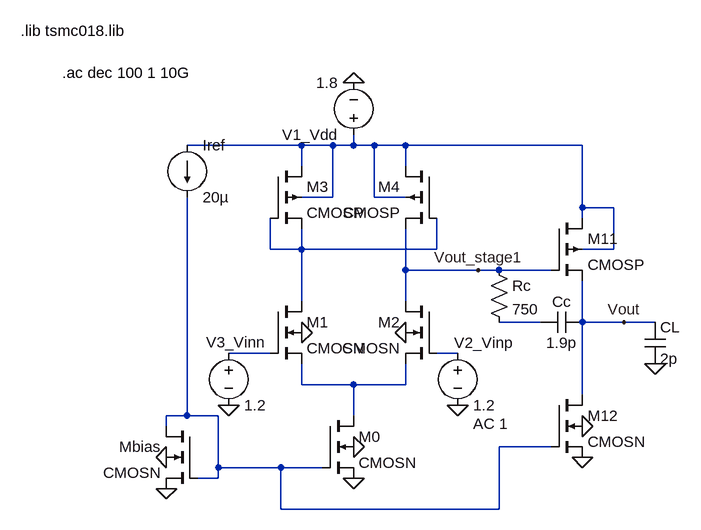
[diagram p0: schematic stage12_ac_refined_gui.asc]
stage12_ac_refined_gui.asc, the LTspice schematic file:
Version 4.1
SHEET 1 880 680
WIRE 96 -128 -80 -128
WIRE 144 -128 96 -128
WIRE 176 -128 176 -144
WIRE 176 -128 144 -128
WIRE 208 -128 176 -128
WIRE 256 -128 208 -128
WIRE 528 -128 256 -128
WIRE 96 -96 96 -128
WIRE 256 -96 256 -128
WIRE 144 -48 144 -128
WIRE 144 -48 96 -48
WIRE 208 -48 208 -128
WIRE 256 -48 208 -48
WIRE 528 -32 528 -128
WIRE 576 -32 528 -32
WIRE 528 -16 528 -32
WIRE 48 32 48 -16
WIRE 96 32 96 0
WIRE 96 32 48 32
WIRE 304 32 304 -16
WIRE 304 32 96 32
WIRE 576 32 576 -32
WIRE 576 32 528 32
WIRE 256 64 256 0
WIRE 368 64 256 64
WIRE 400 64 368 64
WIRE 480 64 400 64
WIRE 96 112 96 32
WIRE 256 112 256 64
WIRE 464 144 400 144
WIRE 528 144 528 80
WIRE 592 144 528 144
WIRE 640 144 592 144
WIRE 48 192 -16 192
WIRE 336 192 304 192
WIRE 96 240 96 208
WIRE 176 240 96 240
WIRE 256 240 256 208
WIRE 256 240 176 240
WIRE 528 256 528 144
WIRE -80 288 -80 -48
WIRE -80 288 -112 288
WIRE -32 288 -80 288
WIRE 176 288 176 240
WIRE -112 304 -112 288
WIRE 480 336 400 336
WIRE -32 368 -32 288
WIRE 64 368 -32 368
WIRE 128 368 64 368
WIRE -32 384 -32 368
WIRE -32 384 -64 384
WIRE 64 432 64 368
WIRE 400 432 400 336
WIRE 400 432 64 432
FLAG 176 -224 0
FLAG -112 352 0
FLAG 176 336 0
FLAG 96 160 0
FLAG 256 160 0
FLAG 336 272 0
FLAG -16 272 0
FLAG -112 400 0
FLAG 176 384 0
FLAG 640 208 0
FLAG 528 352 0
FLAG 528 304 0
FLAG 592 144 Vout
FLAG 368 64 Vout_stage1
SYMBOL cmosn 48 112 R0
SYMATTR InstName M1
SYMATTR Value2 l=0.5u w=11u
SYMBOL cmosp 304 -96 M0
SYMATTR InstName M4
SYMATTR Value2 l=0.5u w=25u
SYMBOL cmosn 304 112 M0
SYMATTR InstName M2
SYMATTR Value2 l=0.5u w=11u
SYMBOL cmosp 48 -96 R0
SYMATTR InstName M3
SYMATTR Value2 l=0.5u w=25u
SYMBOL cmosn 128 288 R0
SYMATTR InstName M0
SYMATTR Value2 l=0.5u w=10u
SYMBOL cmosn -64 304 M0
SYMATTR InstName Mbias
SYMATTR Value2 l=0.36u w=1.44u
SYMBOL voltage 176 -128 R180
WINDOW 123 0 0 Left 0
WINDOW 39 0 0 Left 0
SYMATTR InstName V1_Vdd
SYMATTR Value 1.8
SYMBOL voltage 336 176 R0
WINDOW 123 24 124 Left 2
WINDOW 39 0 0 Left 0
WINDOW 0 -5 0 Left 2
SYMATTR Value2 AC 1
SYMATTR InstName V2_Vinp
SYMATTR Value 1.2
SYMBOL voltage -16 176 R0
WINDOW 123 24 124 Left 2
WINDOW 39 0 0 Left 0
WINDOW 0 -35 -1 Left 2
SYMATTR InstName V3_Vinn
SYMATTR Value 1.2
SYMBOL current -80 -128 R0
WINDOW 123 0 0 Left 0
WINDOW 39 0 0 Left 0
SYMATTR InstName Iref
SYMATTR Value 20µ
SYMBOL cmosp 480 -16 R0
SYMATTR InstName M11
SYMATTR Value2 l=0.5u w=78.5u
SYMBOL cmosn 480 256 R0
SYMATTR InstName M12
SYMATTR Value2 l=0.5u w=15.7u
SYMBOL res 384 48 R0
SYMATTR InstName Rc
SYMATTR Value 750
SYMBOL cap 528 128 R90
WINDOW 0 0 32 VBottom 2
WINDOW 3 32 32 VTop 2
SYMATTR InstName Cc
SYMATTR Value 1.9p
SYMBOL cap 624 144 R0
SYMATTR InstName CL
SYMATTR Value 2p
TEXT -336 -304 Left 2 !.lib tsmc018.lib
TEXT -272 -240 Left 2 !.ac dec 100 1 10G

The netlist it stands for:
* stage12_ac_refined_gui.asc
M1 N002 N004 N006 0 CMOSN l=0.5u w=11u
M4 N001 N002 Vout_stage1 N001 CMOSP l=0.5u w=25u
M2 Vout_stage1 N005 N006 0 CMOSN l=0.5u w=11u
M3 N001 N002 N002 N001 CMOSP l=0.5u w=25u
M0 N006 N007 0 0 CMOSN l=0.5u w=10u
Mbias N007 N007 0 0 CMOSN l=0.36u w=1.44u
V1_Vdd N001 0 1.8
V2_Vinp N005 0 1.2 AC 1
V3_Vinn N004 0 1.2
Iref N001 N007 20µ
M11 N001 Vout_stage1 Vout N001 CMOSP l=0.5u w=78.5u
M12 Vout N007 0 0 CMOSN l=0.5u w=15.7u
Rc Vout_stage1 N003 750
Cc Vout N003 1.9p
CL Vout 0 2p
.model NMOS NMOS
.model PMOS PMOS
.lib standard.mos
.lib tsmc018.lib
.ac dec 100 1 10G
.backanno
.end